# EAGLE design 7segement2digits1badidea-mk-5.1 (EAGLE 6.5.0)
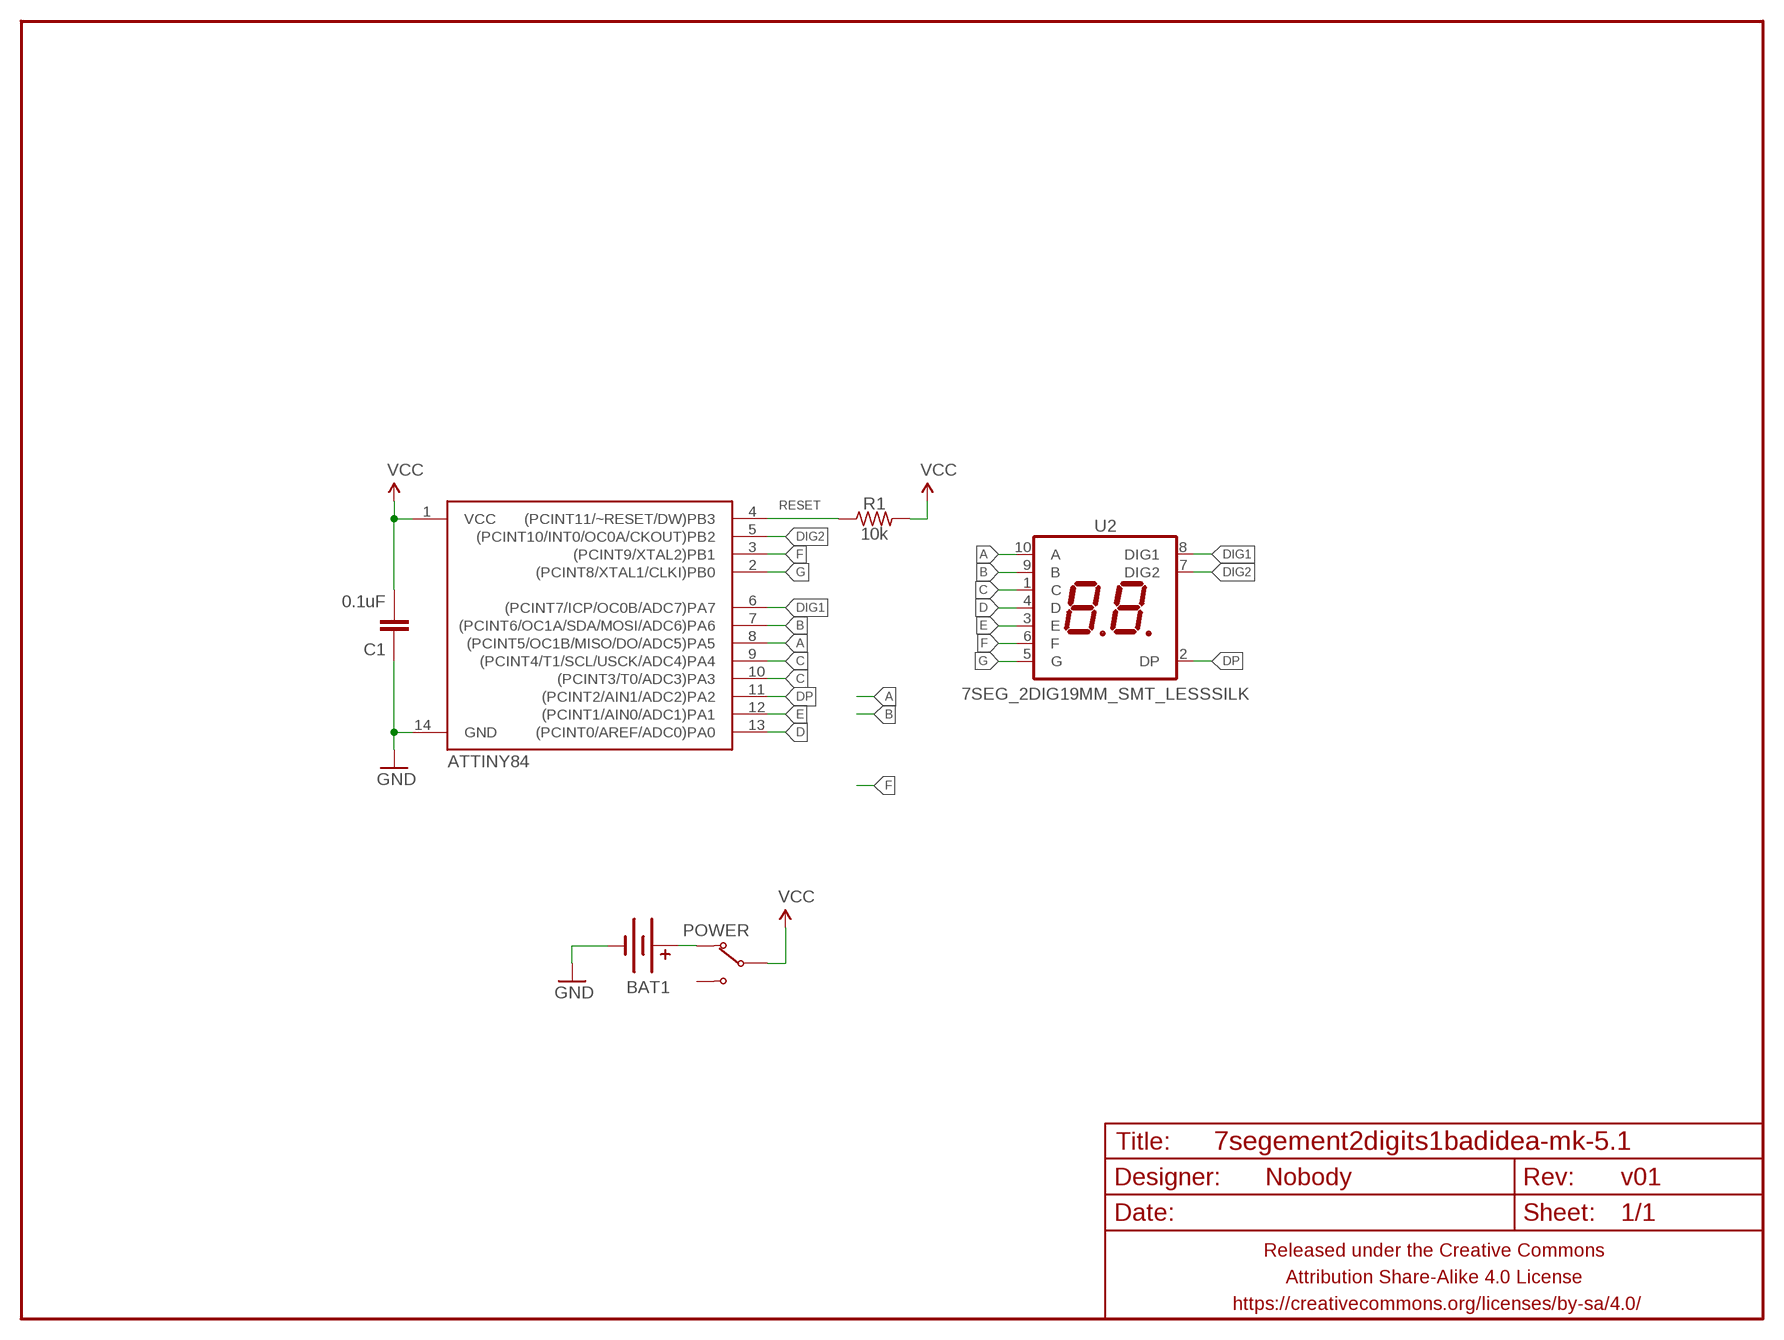
[diagram p0: schematic, sheet 1]

## Parts
BAT1  BATTERY20MM_SMD_TIGHT  [BATTCON_20MM_MINE_STAHPIT]
C1  0.1uF  CAPACITOR-CERAMICC0805  [C0805]
FRAME1  FRAME-LETTERNO_PACKAGE  [DUMMY]
POWER  SWITCH-SPDTPTH-RA-2.54MM  [SPDT-RA-2.54MM]
R1  10k  RESISTORR0805  [R0805]
U1  ATTINY84  [SO14]
U2  7SEG_2DIG19MM_SMT_LESSSILK  [7SEG_2DIG_19MM_SMT_LESSSILK]

## Nets
A: U1.8((PCINT5/OC1B/MISO/DO/ADC5)PA5) U2.10(A)
B: U1.7((PCINT6/OC1A/SDA/MOSI/ADC6)PA6) U2.9(B)
C: U1.9((PCINT4/T1/SCL/USCK/ADC4)PA4) U1.10((PCINT3/T0/ADC3)PA3) U2.1(C)
D: U1.13((PCINT0/AREF/ADC0)PA0) U2.4(D)
DIG1: U1.6((PCINT7/ICP/OC0B/ADC7)PA7) U2.8(DIG1)
DIG2: U1.5((PCINT10/INT0/OC0A/CKOUT)PB2) U2.7(DIG2)
DP: U1.11((PCINT2/AIN1/ADC2)PA2) U2.2(DP)
E: U1.12((PCINT1/AIN0/ADC1)PA1) U2.3(E)
F: U1.3((PCINT9/XTAL2)PB1) U2.6(F)
G: U1.2((PCINT8/XTAL1/CLKI)PB0) U2.5(G)
GND: BAT1.BOTTOM(-) C1.1 U1.14(GND)
N$1: BAT1.TOP@1(+) BAT1.TOP@2(+) POWER.1(NC)
RESET: R1.1 U1.4((PCINT11/~RESET/DW)PB3)
VCC: C1.2 POWER.2(COM) R1.2 U1.1(VCC)
Unconnected: POWER.3(NO)

## Library data of the parts
BAT1 = A_butts:BATTERY: Battery Holders Various common sizes : AA, AAA, 20mm coin cell and 12mm coin cell. 20MM_4LEGS, BATT-10373
C1 = A_butts:CAPACITOR-CERAMIC: CAPACITOR, European symbol
FRAME1 = A_butts:FRAME-LETTER: Schematic Frame Standard 8.5x11 US Letter frame; DESIGNER: Nobody; VERSION: v01
POWER = A_butts:SWITCH-SPDT
R1 = A_butts:RESISTOR: RESISTOR, American symbol
U1 = A_butts:ATTINY84: Atmel 14-pin 2/4/8kB flash uC
U2 = A_butts:7SEG_2DIG

## Board
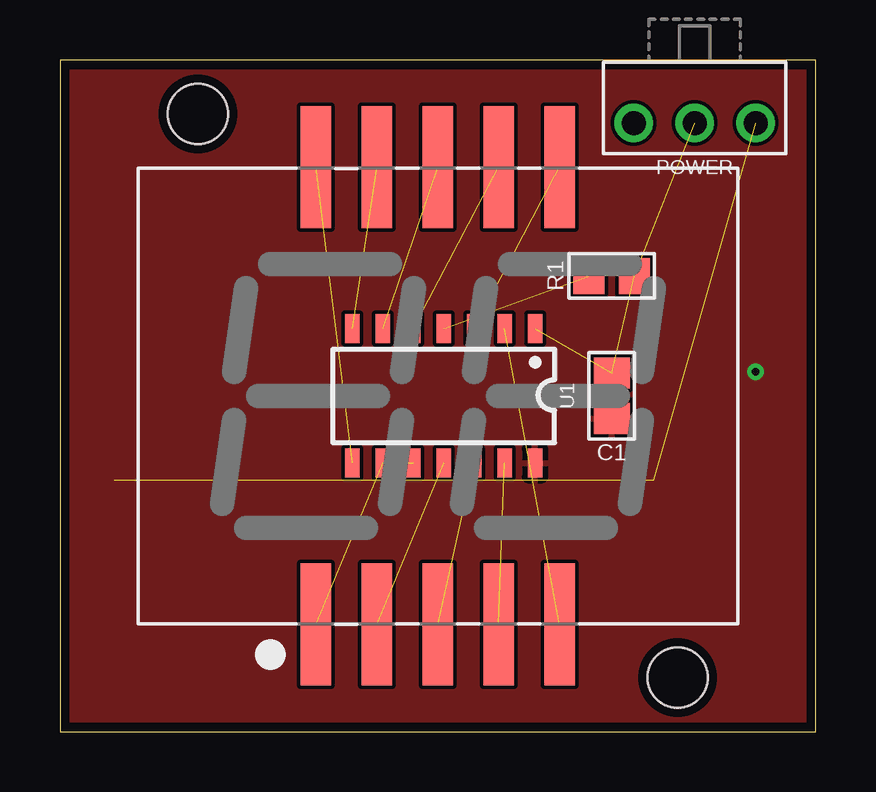
[diagram p1: board, top side]
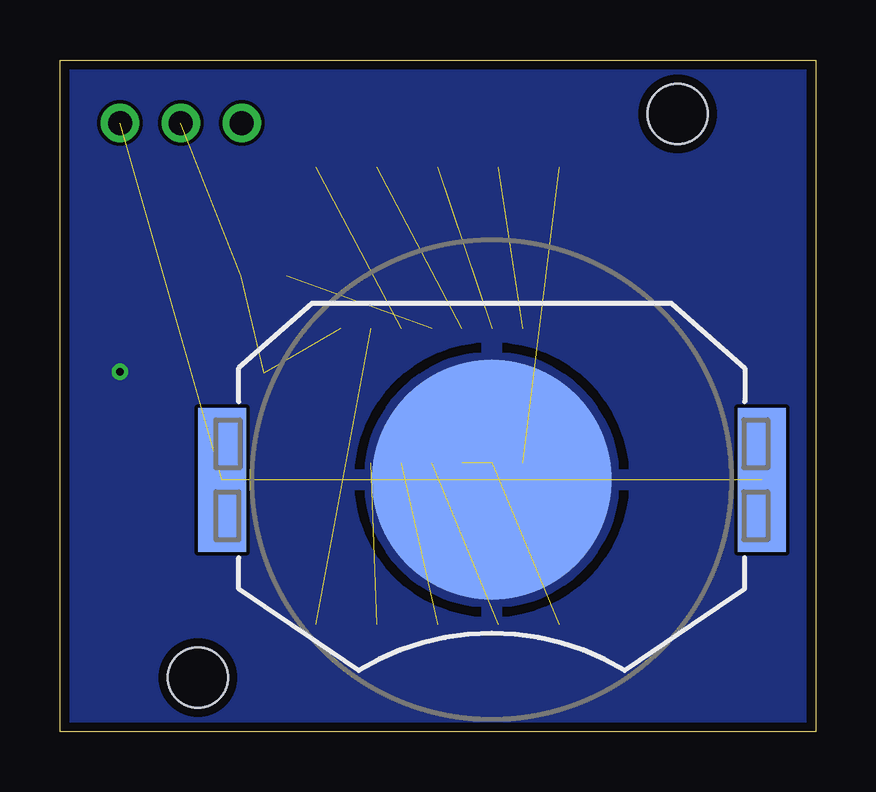
[diagram p2: board, bottom side, seen from below]

Size 31.5 x 28 mm. Coordinates in mm from the lower left corner, seen from the top.
Outline: 0,28 0,0 31.5,0 31.5,28 0,28
Copper layers (1*16): Top 0.0356mm / dielectric 1.5011mm / Bottom 0.0356mm
Design rules "LaenPCBOrder_2": minimum track width 6mil, minimum drill 13mil, track to track 6mil, track to pad 6mil, pad to pad 6mil, via to via 6mil, smd to smd 6mil, copper to edge 15mil, drill to drill 6mil, minimum pad ring 7mil, minimum via ring 7mil, stop-mask expansion 3mil, vias tented up to drill 20mil, thermal gap 10mil
Holes 2.5 mm at 5.75,25.75 25.75,2.25

### Footprints (pad centres in the part's own frame; a part is rotated, then mirrored left to right if it is on the bottom)
BATTCON_20MM_MINE_STAHPIT = smd 10 x 10: BOTTOM 0,0 | smd 6 x 2: TOP@1 0,11.25; TOP@2 0,-11.25
C0805 = smd 1.3 x 1.5: 1 -0.95,0; 2 0.95,0
SPDT-RA-2.54MM = drill 1 pad 1.6: 1 0,0; 2 2.54,0; 3 5.08,0
R0805 = smd 1.3 x 1.5: 1 -0.95,0; 2 0.95,0
SO14 = smd 0.6 x 1.2: 1 -3.81,-2.8; 2 -2.54,-2.8; 3 -1.27,-2.8; 4 0,-2.8; 5 1.27,-2.8; 6 2.54,-2.8; 7 3.81,-2.8; 8 3.81,2.8; 9 2.54,2.8; 10 1.27,2.8; 11 0,2.8; 12 -1.27,2.8; 13 -2.54,2.8; 14 -3.81,2.8
7SEG_2DIG_19MM_SMT_LESSSILK = smd 1.27 x 5.08: 1 -5.08,-9.525; 2 -2.54,-9.525; 3 0,-9.525; 4 2.54,-9.525; 5 5.08,-9.525; 6 5.08,9.525; 7 2.54,9.525; 8 0,9.525; 9 -2.54,9.525; 10 -5.08,9.525

### Placement (x,y rotation side)
BAT1  13.5,10.5 270 bottom
C1  23,14 90 top
FRAME1  0,-0.5 0 top
POWER  29,25.37 180 top
R1  23,19 0 top
U1  16,14 180 top
U2  15.75,14 0 top

### Tracks (layer width: path | path; a pad name or v marks a point on that pad's centre or on a via)
A  (1 unrouted)
B  (1 unrouted)
C  (2 unrouted)
D  (1 unrouted)
DIG1  (1 unrouted)
DIG2  (1 unrouted)
DP  (1 unrouted)
E  (1 unrouted)
F  (1 unrouted)
G  (1 unrouted)
GND  (via drill 0.33)
  other vias: 29,15
  pour Top: 31.6,28.1 31.6,-0.1 -0.1,-0.1 -0.1,28.1
  pour Bottom: -0.1,-0.1 -0.1,28.1 31.6,28.1 31.6,-0.1
N$1  (2 unrouted)
RESET  (1 unrouted)
VCC  (3 unrouted)